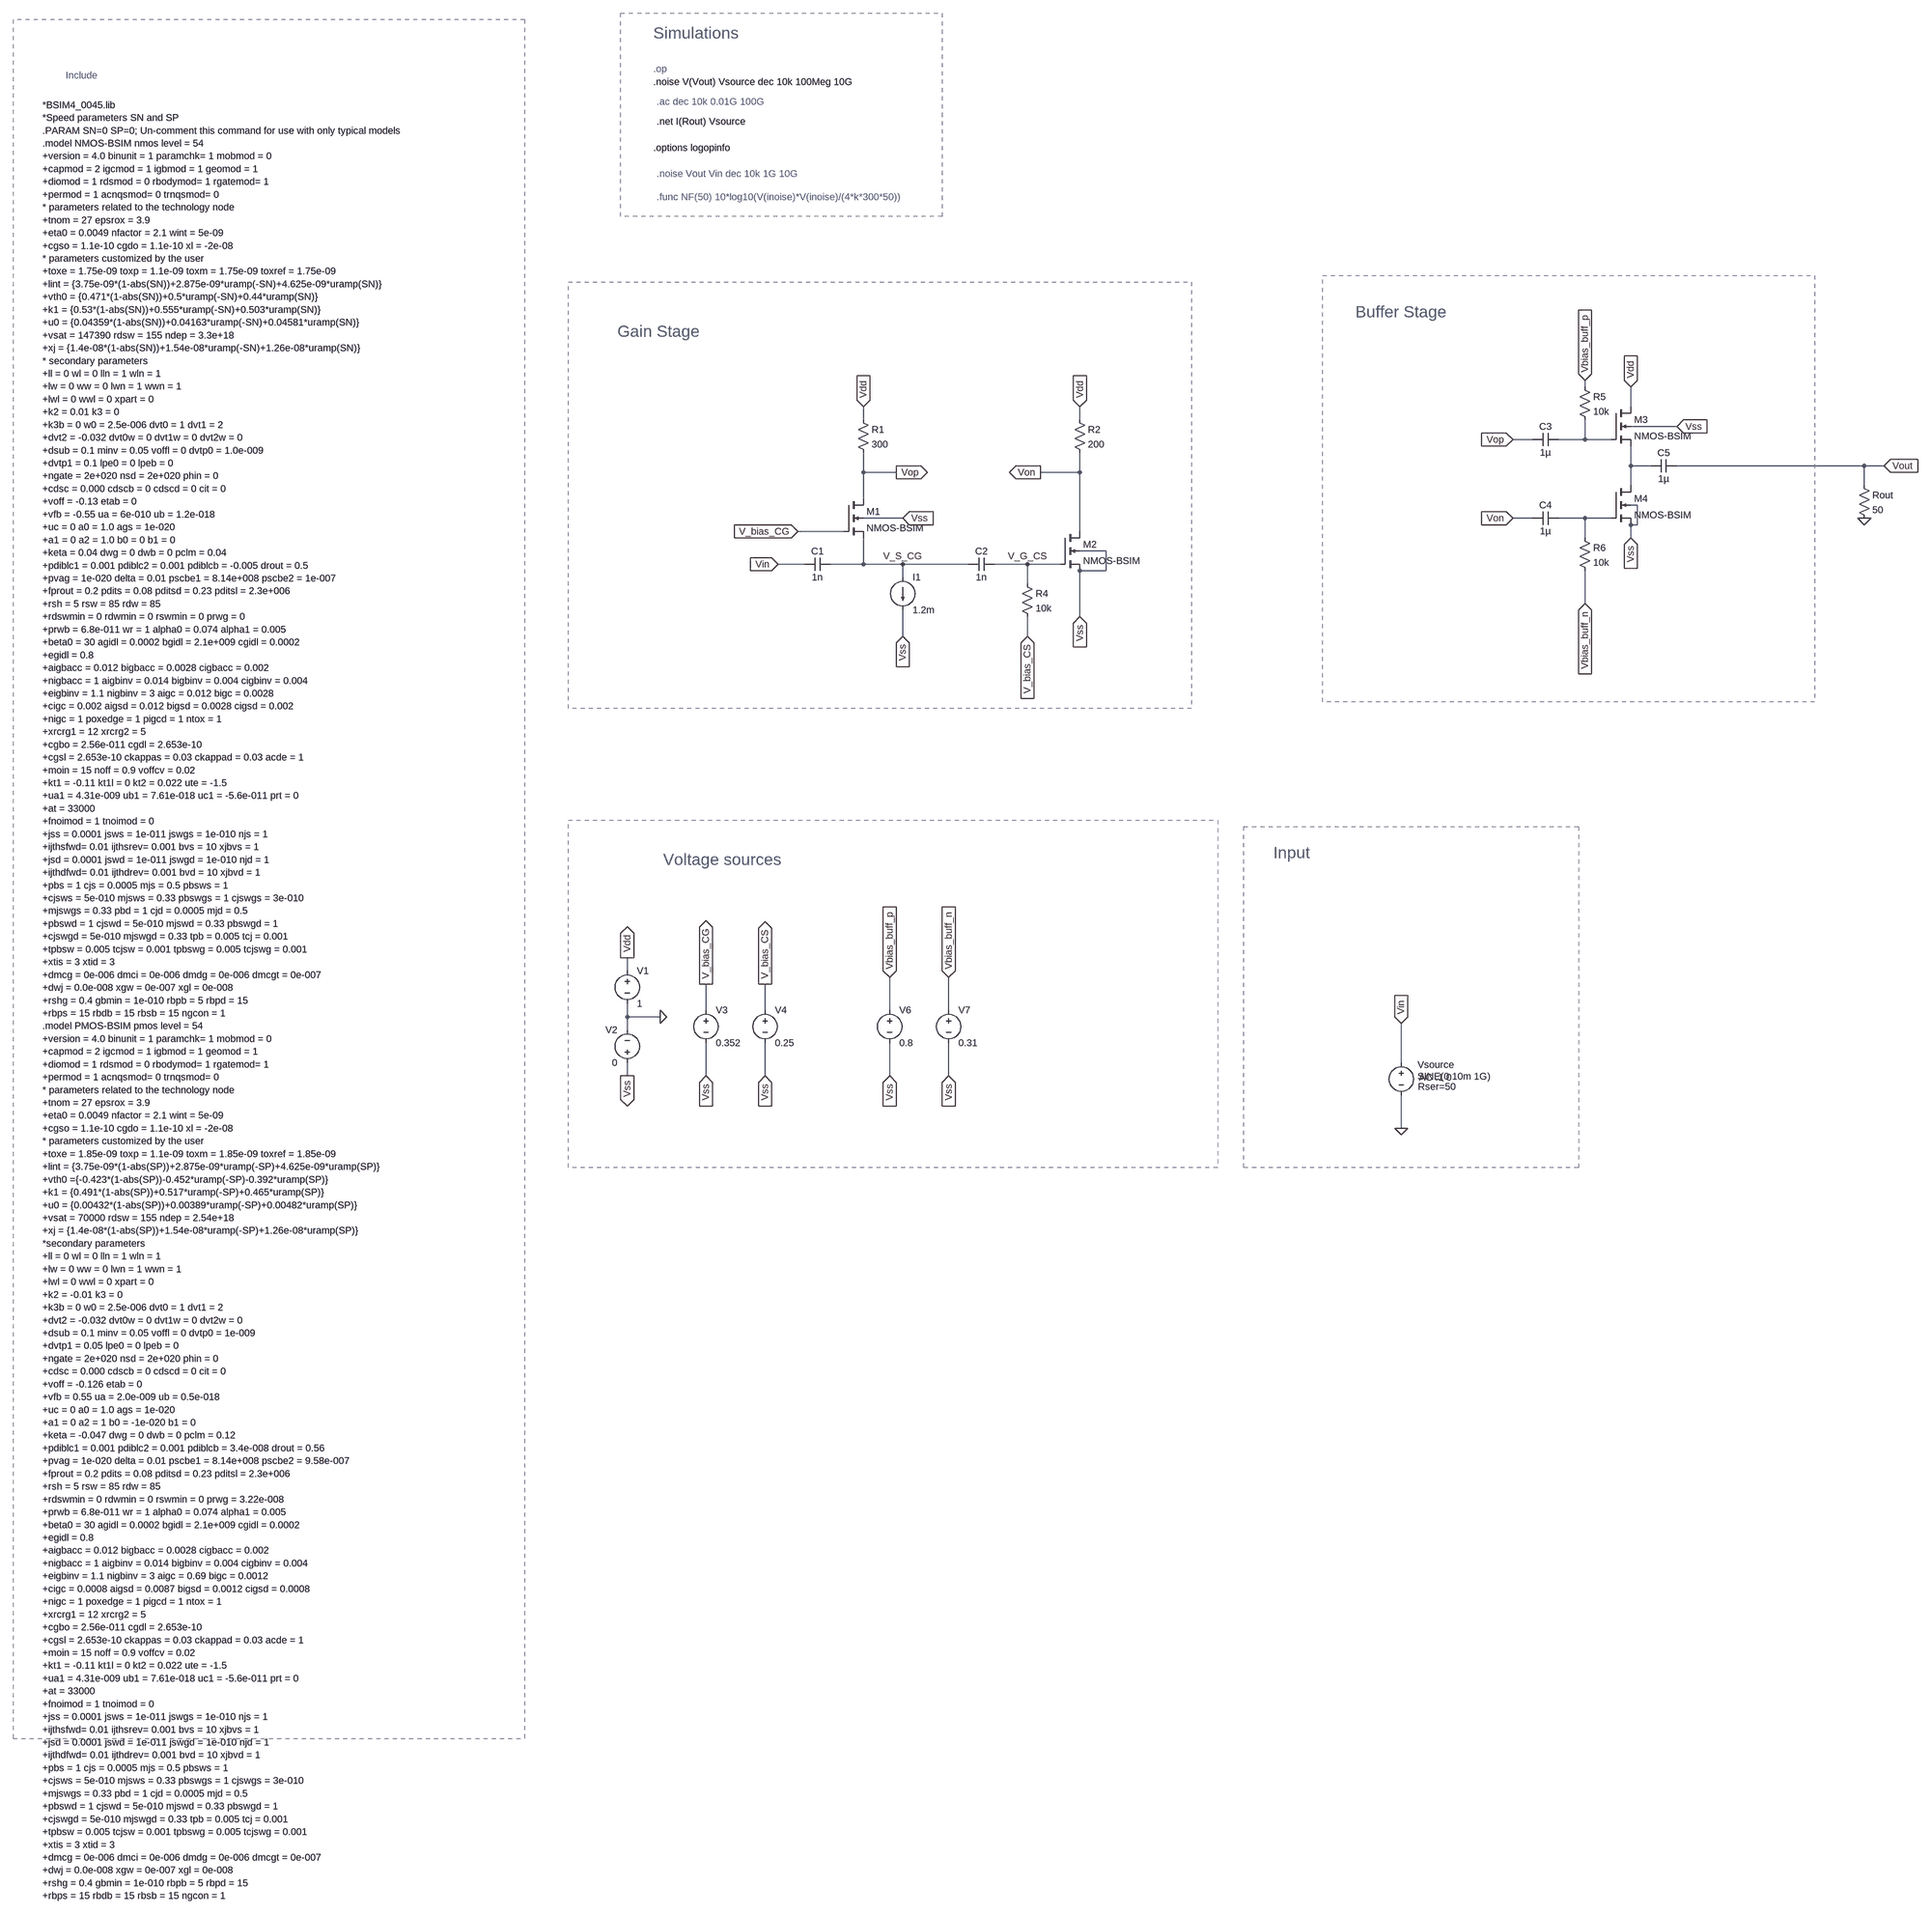
[diagram p0: schematic Nmos_LNA_45_1To1.asc]
Nmos_LNA_45_1To1.asc, the LTspice schematic file:
Version 4.1
SHEET 1 4244 3652
WIRE 3168 352 3168 336
WIRE 3280 400 3280 352
WIRE 1408 432 1408 400
WIRE 1936 432 1936 400
WIRE 3392 448 3280 448
WIRE 3040 480 2992 480
WIRE 3168 480 3168 432
WIRE 3168 480 3104 480
WIRE 3232 480 3168 480
WIRE 3280 544 3280 496
WIRE 3328 544 3280 544
WIRE 3856 544 3392 544
WIRE 3904 544 3856 544
WIRE 1408 560 1408 512
WIRE 1488 560 1408 560
WIRE 1936 560 1936 512
WIRE 1936 560 1840 560
WIRE 3280 592 3280 544
WIRE 3856 592 3856 544
WIRE 1408 624 1408 560
WIRE 3296 640 3280 640
WIRE 1504 672 1408 672
WIRE 3040 672 2992 672
WIRE 3168 672 3104 672
WIRE 3232 672 3168 672
WIRE 3296 688 3296 640
WIRE 3296 688 3280 688
WIRE 1360 704 1248 704
WIRE 1936 704 1936 560
WIRE 3168 720 3168 672
WIRE 3280 720 3280 688
WIRE 2000 752 1936 752
WIRE 1264 784 1200 784
WIRE 1408 784 1408 720
WIRE 1408 784 1328 784
WIRE 1504 784 1408 784
WIRE 1664 784 1504 784
WIRE 1808 784 1728 784
WIRE 1888 784 1808 784
WIRE 2000 800 2000 752
WIRE 2000 800 1936 800
WIRE 1504 816 1504 784
WIRE 1808 832 1808 784
WIRE 3168 880 3168 800
WIRE 1936 912 1936 800
WIRE 1504 960 1504 896
WIRE 1808 960 1808 912
WIRE 832 1776 832 1744
WIRE 1024 1872 1024 1808
WIRE 1168 1872 1168 1808
WIRE 1472 1872 1472 1792
WIRE 1616 1872 1616 1792
WIRE 832 1888 832 1856
WIRE 912 1888 832 1888
WIRE 832 1920 832 1888
WIRE 2720 2000 2720 1904
WIRE 832 2032 832 2000
WIRE 1024 2032 1024 1952
WIRE 1168 2032 1168 1952
WIRE 1472 2032 1472 1952
WIRE 1616 2032 1616 1952
WIRE 2720 2160 2720 2080
FLAG 1200 784 Vin
IOPIN 1200 784 In
FLAG 912 1888 0
FLAG 832 1744 Vdd
IOPIN 832 1744 Out
FLAG 832 2032 Vss
IOPIN 832 2032 Out
FLAG 1248 704 V_bias_CG
IOPIN 1248 704 In
FLAG 1504 960 Vss
IOPIN 1504 960 In
FLAG 1504 672 Vss
IOPIN 1504 672 In
FLAG 1936 912 Vss
IOPIN 1936 912 In
FLAG 1408 400 Vdd
IOPIN 1408 400 In
FLAG 1936 400 Vdd
IOPIN 1936 400 In
FLAG 1024 2032 Vss
IOPIN 1024 2032 In
FLAG 1024 1808 V_bias_CG
IOPIN 1024 1808 Out
FLAG 1488 560 Vop
IOPIN 1488 560 Out
FLAG 1840 560 Von
IOPIN 1840 560 Out
FLAG 1808 960 V_bias_CS
IOPIN 1808 960 In
FLAG 1168 1808 V_bias_CS
IOPIN 1168 1808 Out
FLAG 1168 2032 Vss
IOPIN 1168 2032 In
FLAG 2720 2160 0
FLAG 2720 1904 Vin
IOPIN 2720 1904 In
FLAG 1808 784 V_G_CS
FLAG 1504 784 V_S_CG
FLAG 3392 448 Vss
IOPIN 3392 448 In
FLAG 3280 720 Vss
IOPIN 3280 720 In
FLAG 2992 480 Vop
IOPIN 2992 480 In
FLAG 2992 672 Von
IOPIN 2992 672 In
FLAG 3280 352 Vdd
IOPIN 3280 352 In
FLAG 3904 544 Vout
IOPIN 3904 544 In
FLAG 3168 880 Vbias_buff_n
IOPIN 3168 880 In
FLAG 3168 336 Vbias_buff_p
IOPIN 3168 336 In
FLAG 1472 2032 Vss
IOPIN 1472 2032 In
FLAG 1616 2032 Vss
IOPIN 1616 2032 In
FLAG 1472 1792 Vbias_buff_p
IOPIN 1472 1792 In
FLAG 1616 1792 Vbias_buff_n
IOPIN 1616 1792 In
FLAG 3856 672 0
DATAFLAG 1936 560 ""
DATAFLAG 3296 544 ""
DATAFLAG 1408 784 ""
DATAFLAG 1248 784 ""
DATAFLAG 1248 784 ""
DATAFLAG 1936 624 ""
DATAFLAG 1408 560 ""
SYMBOL voltage 832 1760 R0
WINDOW 123 0 0 Left 0
WINDOW 39 0 0 Left 0
SYMATTR InstName V1
SYMATTR Value 1
SYMBOL voltage 832 2016 R180
WINDOW 0 24 96 Left 2
WINDOW 3 24 16 Left 2
WINDOW 123 0 0 Left 0
WINDOW 39 0 0 Left 0
SYMATTR InstName V2
SYMATTR Value 0
SYMBOL current 1504 816 R0
WINDOW 123 0 0 Left 0
WINDOW 39 0 0 Left 0
SYMATTR InstName I1
SYMATTR Value 1.2m
SYMBOL res 1392 416 R0
SYMATTR InstName R1
SYMATTR Value 300
SYMBOL res 1920 416 R0
SYMATTR InstName R2
SYMATTR Value 200
SYMBOL voltage 1024 1856 R0
WINDOW 123 0 0 Left 0
WINDOW 39 0 0 Left 0
SYMATTR InstName V3
SYMATTR Value 0.352
SYMBOL cap 1328 768 R90
WINDOW 0 0 32 VBottom 2
WINDOW 3 32 32 VTop 2
SYMATTR InstName C1
SYMATTR Value 1n
SYMBOL cap 1728 768 R90
WINDOW 0 0 32 VBottom 2
WINDOW 3 32 32 VTop 2
SYMATTR InstName C2
SYMATTR Value 1n
SYMBOL voltage 1168 1856 R0
WINDOW 123 0 0 Left 0
WINDOW 39 0 0 Left 0
SYMATTR InstName V4
SYMATTR Value 0.25
SYMBOL nmos4 1888 704 R0
SYMATTR InstName M2
SYMATTR Value NMOS-BSIM
SYMATTR Value2 l=60n w=25u
SYMBOL nmos4 1360 624 R0
SYMATTR InstName M1
SYMATTR Value NMOS-BSIM
SYMATTR Value2 l=80n w=40u
SYMBOL voltage 2720 1984 R0
WINDOW 123 43 52 Left 2
WINDOW 39 41 74 Left 2
WINDOW 0 40 21 Left 2
WINDOW 3 40 49 Left 2
SYMATTR Value2 AC .1 0
SYMATTR SpiceLine Rser=50
SYMATTR InstName Vsource
SYMATTR Value SINE(0 10m 1G)
SYMBOL res 1792 816 R0
SYMATTR InstName R4
SYMATTR Value 10k
SYMBOL cap 3104 464 R90
WINDOW 0 0 32 VBottom 2
WINDOW 3 32 32 VTop 2
SYMATTR InstName C3
SYMATTR Value 1µ
SYMBOL cap 3104 656 R90
WINDOW 0 0 32 VBottom 2
WINDOW 3 32 32 VTop 2
SYMATTR InstName C4
SYMATTR Value 1µ
SYMBOL nmos4 3232 400 R0
SYMATTR InstName M3
SYMATTR Value NMOS-BSIM
SYMATTR Value2 l=90n w=65u
SYMBOL nmos4 3232 592 R0
SYMATTR InstName M4
SYMATTR Value NMOS-BSIM
SYMATTR Value2 l=90n w=65u
SYMBOL voltage 1472 1856 R0
WINDOW 123 0 0 Left 0
WINDOW 39 0 0 Left 0
SYMATTR InstName V6
SYMATTR Value 0.8
SYMBOL voltage 1616 1856 R0
WINDOW 123 0 0 Left 0
WINDOW 39 0 0 Left 0
SYMATTR InstName V7
SYMATTR Value 0.31
SYMBOL res 3152 336 R0
SYMATTR InstName R5
SYMATTR Value 10k
SYMBOL res 3152 704 R0
SYMATTR InstName R6
SYMATTR Value 10k
SYMBOL cap 3392 528 R90
WINDOW 0 0 32 VBottom 2
WINDOW 3 32 32 VTop 2
SYMATTR InstName C5
SYMATTR Value 1µ
SYMBOL res 3840 576 R0
SYMATTR InstName Rout
SYMATTR Value 50
TEXT -1064 -336 Left 2 !*BSIM4_0045.lib\n*Speed parameters SN and SP\n.PARAM SN=0 SP=0; Un-comment this command for use with only typical models\n.model NMOS-BSIM nmos level = 54\n+version = 4.0 binunit = 1 paramchk= 1 mobmod = 0\n+capmod = 2 igcmod = 1 igbmod = 1 geomod = 1\n+diomod = 1 rdsmod = 0 rbodymod= 1 rgatemod= 1\n+permod = 1 acnqsmod= 0 trnqsmod= 0\n* parameters related to the technology node\n+tnom = 27 epsrox = 3.9\n+eta0 = 0.0049 nfactor = 2.1 wint = 5e-09\n+cgso = 1.1e-10 cgdo = 1.1e-10 xl = -2e-08\n* parameters customized by the user\n+toxe = 1.75e-09 toxp = 1.1e-09 toxm = 1.75e-09 toxref = 1.75e-09\n+lint = {3.75e-09*(1-abs(SN))+2.875e-09*uramp(-SN)+4.625e-09*uramp(SN)}\n+vth0 = {0.471*(1-abs(SN))+0.5*uramp(-SN)+0.44*uramp(SN)}\n+k1 = {0.53*(1-abs(SN))+0.555*uramp(-SN)+0.503*uramp(SN)}\n+u0 = {0.04359*(1-abs(SN))+0.04163*uramp(-SN)+0.04581*uramp(SN)}\n+vsat = 147390 rdsw = 155 ndep = 3.3e+18\n+xj = {1.4e-08*(1-abs(SN))+1.54e-08*uramp(-SN)+1.26e-08*uramp(SN)}\n* secondary parameters\n+ll = 0 wl = 0 lln = 1 wln = 1\n+lw = 0 ww = 0 lwn = 1 wwn = 1\n+lwl = 0 wwl = 0 xpart = 0\n+k2 = 0.01 k3 = 0\n+k3b = 0 w0 = 2.5e-006 dvt0 = 1 dvt1 = 2\n+dvt2 = -0.032 dvt0w = 0 dvt1w = 0 dvt2w = 0\n+dsub = 0.1 minv = 0.05 voffl = 0 dvtp0 = 1.0e-009\n+dvtp1 = 0.1 lpe0 = 0 lpeb = 0\n+ngate = 2e+020 nsd = 2e+020 phin = 0\n+cdsc = 0.000 cdscb = 0 cdscd = 0 cit = 0\n+voff = -0.13 etab = 0\n+vfb = -0.55 ua = 6e-010 ub = 1.2e-018\n+uc = 0 a0 = 1.0 ags = 1e-020\n+a1 = 0 a2 = 1.0 b0 = 0 b1 = 0\n+keta = 0.04 dwg = 0 dwb = 0 pclm = 0.04\n+pdiblc1 = 0.001 pdiblc2 = 0.001 pdiblcb = -0.005 drout = 0.5\n+pvag = 1e-020 delta = 0.01 pscbe1 = 8.14e+008 pscbe2 = 1e-007\n+fprout = 0.2 pdits = 0.08 pditsd = 0.23 pditsl = 2.3e+006\n+rsh = 5 rsw = 85 rdw = 85\n+rdswmin = 0 rdwmin = 0 rswmin = 0 prwg = 0\n+prwb = 6.8e-011 wr = 1 alpha0 = 0.074 alpha1 = 0.005\n+beta0 = 30 agidl = 0.0002 bgidl = 2.1e+009 cgidl = 0.0002\n+egidl = 0.8\n+aigbacc = 0.012 bigbacc = 0.0028 cigbacc = 0.002\n+nigbacc = 1 aigbinv = 0.014 bigbinv = 0.004 cigbinv = 0.004\n+eigbinv = 1.1 nigbinv = 3 aigc = 0.012 bigc = 0.0028\n+cigc = 0.002 aigsd = 0.012 bigsd = 0.0028 cigsd = 0.002\n+nigc = 1 poxedge = 1 pigcd = 1 ntox = 1\n+xrcrg1 = 12 xrcrg2 = 5\n+cgbo = 2.56e-011 cgdl = 2.653e-10\n+cgsl = 2.653e-10 ckappas = 0.03 ckappad = 0.03 acde = 1\n+moin = 15 noff = 0.9 voffcv = 0.02\n+kt1 = -0.11 kt1l = 0 kt2 = 0.022 ute = -1.5\n+ua1 = 4.31e-009 ub1 = 7.61e-018 uc1 = -5.6e-011 prt = 0\n+at = 33000\n+fnoimod = 1 tnoimod = 0\n+jss = 0.0001 jsws = 1e-011 jswgs = 1e-010 njs = 1\n+ijthsfwd= 0.01 ijthsrev= 0.001 bvs = 10 xjbvs = 1\n+jsd = 0.0001 jswd = 1e-011 jswgd = 1e-010 njd = 1\n+ijthdfwd= 0.01 ijthdrev= 0.001 bvd = 10 xjbvd = 1\n+pbs = 1 cjs = 0.0005 mjs = 0.5 pbsws = 1\n+cjsws = 5e-010 mjsws = 0.33 pbswgs = 1 cjswgs = 3e-010\n+mjswgs = 0.33 pbd = 1 cjd = 0.0005 mjd = 0.5\n+pbswd = 1 cjswd = 5e-010 mjswd = 0.33 pbswgd = 1\n+cjswgd = 5e-010 mjswgd = 0.33 tpb = 0.005 tcj = 0.001\n+tpbsw = 0.005 tcjsw = 0.001 tpbswg = 0.005 tcjswg = 0.001\n+xtis = 3 xtid = 3\n+dmcg = 0e-006 dmci = 0e-006 dmdg = 0e-006 dmcgt = 0e-007\n+dwj = 0.0e-008 xgw = 0e-007 xgl = 0e-008\n+rshg = 0.4 gbmin = 1e-010 rbpb = 5 rbpd = 15\n+rbps = 15 rbdb = 15 rbsb = 15 ngcon = 1\n.model PMOS-BSIM pmos level = 54\n+version = 4.0 binunit = 1 paramchk= 1 mobmod = 0\n+capmod = 2 igcmod = 1 igbmod = 1 geomod = 1\n+diomod = 1 rdsmod = 0 rbodymod= 1 rgatemod= 1\n+permod = 1 acnqsmod= 0 trnqsmod= 0\n* parameters related to the technology node\n+tnom = 27 epsrox = 3.9\n+eta0 = 0.0049 nfactor = 2.1 wint = 5e-09\n+cgso = 1.1e-10 cgdo = 1.1e-10 xl = -2e-08\n* parameters customized by the user\n+toxe = 1.85e-09 toxp = 1.1e-09 toxm = 1.85e-09 toxref = 1.85e-09\n+lint = {3.75e-09*(1-abs(SP))+2.875e-09*uramp(-SP)+4.625e-09*uramp(SP)}\n+vth0 ={-0.423*(1-abs(SP))-0.452*uramp(-SP)-0.392*uramp(SP)}\n+k1 = {0.491*(1-abs(SP))+0.517*uramp(-SP)+0.465*uramp(SP)}\n+u0 = {0.00432*(1-abs(SP))+0.00389*uramp(-SP)+0.00482*uramp(SP)}\n+vsat = 70000 rdsw = 155 ndep = 2.54e+18\n+xj = {1.4e-08*(1-abs(SP))+1.54e-08*uramp(-SP)+1.26e-08*uramp(SP)}\n*secondary parameters\n+ll = 0 wl = 0 lln = 1 wln = 1\n+lw = 0 ww = 0 lwn = 1 wwn = 1\n+lwl = 0 wwl = 0 xpart = 0\n+k2 = -0.01 k3 = 0\n+k3b = 0 w0 = 2.5e-006 dvt0 = 1 dvt1 = 2\n+dvt2 = -0.032 dvt0w = 0 dvt1w = 0 dvt2w = 0\n+dsub = 0.1 minv = 0.05 voffl = 0 dvtp0 = 1e-009\n+dvtp1 = 0.05 lpe0 = 0 lpeb = 0\n+ngate = 2e+020 nsd = 2e+020 phin = 0\n+cdsc = 0.000 cdscb = 0 cdscd = 0 cit = 0\n+voff = -0.126 etab = 0\n+vfb = 0.55 ua = 2.0e-009 ub = 0.5e-018\n+uc = 0 a0 = 1.0 ags = 1e-020\n+a1 = 0 a2 = 1 b0 = -1e-020 b1 = 0\n+keta = -0.047 dwg = 0 dwb = 0 pclm = 0.12\n+pdiblc1 = 0.001 pdiblc2 = 0.001 pdiblcb = 3.4e-008 drout = 0.56\n+pvag = 1e-020 delta = 0.01 pscbe1 = 8.14e+008 pscbe2 = 9.58e-007\n+fprout = 0.2 pdits = 0.08 pditsd = 0.23 pditsl = 2.3e+006\n+rsh = 5 rsw = 85 rdw = 85\n+rdswmin = 0 rdwmin = 0 rswmin = 0 prwg = 3.22e-008\n+prwb = 6.8e-011 wr = 1 alpha0 = 0.074 alpha1 = 0.005\n+beta0 = 30 agidl = 0.0002 bgidl = 2.1e+009 cgidl = 0.0002\n+egidl = 0.8\n+aigbacc = 0.012 bigbacc = 0.0028 cigbacc = 0.002\n+nigbacc = 1 aigbinv = 0.014 bigbinv = 0.004 cigbinv = 0.004\n+eigbinv = 1.1 nigbinv = 3 aigc = 0.69 bigc = 0.0012\n+cigc = 0.0008 aigsd = 0.0087 bigsd = 0.0012 cigsd = 0.0008\n+nigc = 1 poxedge = 1 pigcd = 1 ntox = 1\n+xrcrg1 = 12 xrcrg2 = 5\n+cgbo = 2.56e-011 cgdl = 2.653e-10\n+cgsl = 2.653e-10 ckappas = 0.03 ckappad = 0.03 acde = 1\n+moin = 15 noff = 0.9 voffcv = 0.02\n+kt1 = -0.11 kt1l = 0 kt2 = 0.022 ute = -1.5\n+ua1 = 4.31e-009 ub1 = 7.61e-018 uc1 = -5.6e-011 prt = 0\n+at = 33000\n+fnoimod = 1 tnoimod = 0\n+jss = 0.0001 jsws = 1e-011 jswgs = 1e-010 njs = 1\n+ijthsfwd= 0.01 ijthsrev= 0.001 bvs = 10 xjbvs = 1\n+jsd = 0.0001 jswd = 1e-011 jswgd = 1e-010 njd = 1\n+ijthdfwd= 0.01 ijthdrev= 0.001 bvd = 10 xjbvd = 1\n+pbs = 1 cjs = 0.0005 mjs = 0.5 pbsws = 1\n+cjsws = 5e-010 mjsws = 0.33 pbswgs = 1 cjswgs = 3e-010\n+mjswgs = 0.33 pbd = 1 cjd = 0.0005 mjd = 0.5\n+pbswd = 1 cjswd = 5e-010 mjswd = 0.33 pbswgd = 1\n+cjswgd = 5e-010 mjswgd = 0.33 tpb = 0.005 tcj = 0.001\n+tpbsw = 0.005 tcjsw = 0.001 tpbswg = 0.005 tcjswg = 0.001\n+xtis = 3 xtid = 3\n+dmcg = 0e-006 dmci = 0e-006 dmdg = 0e-006 dmcgt = 0e-007\n+dwj = 0.0e-008 xgw = 0e-007 xgl = 0e-008\n+rshg = 0.4 gbmin = 1e-010 rbpb = 5 rbpd = 15\n+rbps = 15 rbdb = 15 rbsb = 15 ngcon = 1
TEXT 920 1504 Left 4 ;Voltage sources
TEXT 896 -424 Left 2 ;.op
TEXT -1008 -408 Left 2 ;Include
TEXT 896 -232 Left 2 !.options logopinfo
TEXT 896 -392 Left 2 !.noise V(Vout) Vsource dec 10k 100Meg 10G
TEXT 904 -296 Left 2 !.net I(Rout) Vsource
TEXT 904 -344 Left 2 ;.ac dec 10k 0.01G 100G
TEXT 896 -512 Left 4 ;Simulations
TEXT 2408 1488 Left 4 ;Input
TEXT 808 216 Left 4 ;Gain Stage
TEXT 2608 168 Left 4 ;Buffer Stage
TEXT 904 -168 Left 2 ;.noise Vout Vin dec 10k 1G 10G
TEXT 904 -112 Left 2 ;.func NF(50) 10*log10(V(inoise)*V(inoise)/(4*k*300*50))
RECTANGLE Normal 2272 2256 688 1408 2
RECTANGLE Normal 3152 2256 2336 1424 2
RECTANGLE Normal 2208 1136 688 96 2
RECTANGLE Normal 3728 1120 2528 80 2
RECTANGLE Normal -1136 3648 112 -544 2
RECTANGLE Normal 1600 -64 816 -560 2

The netlist it stands for:
* Nmos_LNA_45_1To1.asc
V1 Vdd 0 1
V2 Vss 0 0
I1 V_S_CG Vss 1.2m
R1 Vdd Vop 300
R2 Vdd Von 200
V3 V_bias_CG Vss 0.352
C1 V_S_CG Vin 1n
C2 V_G_CS V_S_CG 1n
V4 V_bias_CS Vss 0.25
M2 Von V_G_CS Vss Vss NMOS-BSIM l=60n w=25u
M1 Vop V_bias_CG V_S_CG Vss NMOS-BSIM l=80n w=40u
Vsource Vin 0 SINE(0 10m 1G) AC .1 0 Rser=50
R4 V_G_CS V_bias_CS 10k
C3 N001 Vop 1µ
C4 N003 Von 1µ
M3 Vdd N001 N002 Vss NMOS-BSIM l=90n w=65u
M4 N002 N003 Vss Vss NMOS-BSIM l=90n w=65u
V6 Vbias_buff_p Vss 0.8
V7 Vbias_buff_n Vss 0.31
R5 Vbias_buff_p N001 10k
R6 N003 Vbias_buff_n 10k
C5 Vout N002 1µ
Rout Vout 0 50
.model NMOS NMOS
.model PMOS PMOS
.lib standard.mos
*BSIM4_0045.lib
*Speed parameters SN and SP
.PARAM SN=0 SP=0; Un-comment this command for use with only typical models
.model NMOS-BSIM nmos level = 54
+version = 4.0 binunit = 1 paramchk= 1 mobmod = 0
+capmod = 2 igcmod = 1 igbmod = 1 geomod = 1
+diomod = 1 rdsmod = 0 rbodymod= 1 rgatemod= 1
+permod = 1 acnqsmod= 0 trnqsmod= 0
* parameters related to the technology node
+tnom = 27 epsrox = 3.9
+eta0 = 0.0049 nfactor = 2.1 wint = 5e-09
+cgso = 1.1e-10 cgdo = 1.1e-10 xl = -2e-08
* parameters customized by the user
+toxe = 1.75e-09 toxp = 1.1e-09 toxm = 1.75e-09 toxref = 1.75e-09
+lint = {3.75e-09*(1-abs(SN))+2.875e-09*uramp(-SN)+4.625e-09*uramp(SN)}
+vth0 = {0.471*(1-abs(SN))+0.5*uramp(-SN)+0.44*uramp(SN)}
+k1 = {0.53*(1-abs(SN))+0.555*uramp(-SN)+0.503*uramp(SN)}
+u0 = {0.04359*(1-abs(SN))+0.04163*uramp(-SN)+0.04581*uramp(SN)}
+vsat = 147390 rdsw = 155 ndep = 3.3e+18
+xj = {1.4e-08*(1-abs(SN))+1.54e-08*uramp(-SN)+1.26e-08*uramp(SN)}
* secondary parameters
+ll = 0 wl = 0 lln = 1 wln = 1
+lw = 0 ww = 0 lwn = 1 wwn = 1
+lwl = 0 wwl = 0 xpart = 0
+k2 = 0.01 k3 = 0
+k3b = 0 w0 = 2.5e-006 dvt0 = 1 dvt1 = 2
+dvt2 = -0.032 dvt0w = 0 dvt1w = 0 dvt2w = 0
+dsub = 0.1 minv = 0.05 voffl = 0 dvtp0 = 1.0e-009
+dvtp1 = 0.1 lpe0 = 0 lpeb = 0
+ngate = 2e+020 nsd = 2e+020 phin = 0
+cdsc = 0.000 cdscb = 0 cdscd = 0 cit = 0
+voff = -0.13 etab = 0
+vfb = -0.55 ua = 6e-010 ub = 1.2e-018
+uc = 0 a0 = 1.0 ags = 1e-020
+a1 = 0 a2 = 1.0 b0 = 0 b1 = 0
+keta = 0.04 dwg = 0 dwb = 0 pclm = 0.04
+pdiblc1 = 0.001 pdiblc2 = 0.001 pdiblcb = -0.005 drout = 0.5
+pvag = 1e-020 delta = 0.01 pscbe1 = 8.14e+008 pscbe2 = 1e-007
+fprout = 0.2 pdits = 0.08 pditsd = 0.23 pditsl = 2.3e+006
+rsh = 5 rsw = 85 rdw = 85
+rdswmin = 0 rdwmin = 0 rswmin = 0 prwg = 0
+prwb = 6.8e-011 wr = 1 alpha0 = 0.074 alpha1 = 0.005
+beta0 = 30 agidl = 0.0002 bgidl = 2.1e+009 cgidl = 0.0002
+egidl = 0.8
+aigbacc = 0.012 bigbacc = 0.0028 cigbacc = 0.002
+nigbacc = 1 aigbinv = 0.014 bigbinv = 0.004 cigbinv = 0.004
+eigbinv = 1.1 nigbinv = 3 aigc = 0.012 bigc = 0.0028
+cigc = 0.002 aigsd = 0.012 bigsd = 0.0028 cigsd = 0.002
+nigc = 1 poxedge = 1 pigcd = 1 ntox = 1
+xrcrg1 = 12 xrcrg2 = 5
+cgbo = 2.56e-011 cgdl = 2.653e-10
+cgsl = 2.653e-10 ckappas = 0.03 ckappad = 0.03 acde = 1
+moin = 15 noff = 0.9 voffcv = 0.02
+kt1 = -0.11 kt1l = 0 kt2 = 0.022 ute = -1.5
+ua1 = 4.31e-009 ub1 = 7.61e-018 uc1 = -5.6e-011 prt = 0
+at = 33000
+fnoimod = 1 tnoimod = 0
+jss = 0.0001 jsws = 1e-011 jswgs = 1e-010 njs = 1
+ijthsfwd= 0.01 ijthsrev= 0.001 bvs = 10 xjbvs = 1
+jsd = 0.0001 jswd = 1e-011 jswgd = 1e-010 njd = 1
+ijthdfwd= 0.01 ijthdrev= 0.001 bvd = 10 xjbvd = 1
+pbs = 1 cjs = 0.0005 mjs = 0.5 pbsws = 1
+cjsws = 5e-010 mjsws = 0.33 pbswgs = 1 cjswgs = 3e-010
+mjswgs = 0.33 pbd = 1 cjd = 0.0005 mjd = 0.5
+pbswd = 1 cjswd = 5e-010 mjswd = 0.33 pbswgd = 1
+cjswgd = 5e-010 mjswgd = 0.33 tpb = 0.005 tcj = 0.001
+tpbsw = 0.005 tcjsw = 0.001 tpbswg = 0.005 tcjswg = 0.001
+xtis = 3 xtid = 3
+dmcg = 0e-006 dmci = 0e-006 dmdg = 0e-006 dmcgt = 0e-007
+dwj = 0.0e-008 xgw = 0e-007 xgl = 0e-008
+rshg = 0.4 gbmin = 1e-010 rbpb = 5 rbpd = 15
+rbps = 15 rbdb = 15 rbsb = 15 ngcon = 1
.model PMOS-BSIM pmos level = 54
+version = 4.0 binunit = 1 paramchk= 1 mobmod = 0
+capmod = 2 igcmod = 1 igbmod = 1 geomod = 1
+diomod = 1 rdsmod = 0 rbodymod= 1 rgatemod= 1
+permod = 1 acnqsmod= 0 trnqsmod= 0
* parameters related to the technology node
+tnom = 27 epsrox = 3.9
+eta0 = 0.0049 nfactor = 2.1 wint = 5e-09
+cgso = 1.1e-10 cgdo = 1.1e-10 xl = -2e-08
* parameters customized by the user
+toxe = 1.85e-09 toxp = 1.1e-09 toxm = 1.85e-09 toxref = 1.85e-09
+lint = {3.75e-09*(1-abs(SP))+2.875e-09*uramp(-SP)+4.625e-09*uramp(SP)}
+vth0 ={-0.423*(1-abs(SP))-0.452*uramp(-SP)-0.392*uramp(SP)}
+k1 = {0.491*(1-abs(SP))+0.517*uramp(-SP)+0.465*uramp(SP)}
+u0 = {0.00432*(1-abs(SP))+0.00389*uramp(-SP)+0.00482*uramp(SP)}
+vsat = 70000 rdsw = 155 ndep = 2.54e+18
+xj = {1.4e-08*(1-abs(SP))+1.54e-08*uramp(-SP)+1.26e-08*uramp(SP)}
*secondary parameters
+ll = 0 wl = 0 lln = 1 wln = 1
+lw = 0 ww = 0 lwn = 1 wwn = 1
+lwl = 0 wwl = 0 xpart = 0
+k2 = -0.01 k3 = 0
+k3b = 0 w0 = 2.5e-006 dvt0 = 1 dvt1 = 2
+dvt2 = -0.032 dvt0w = 0 dvt1w = 0 dvt2w = 0
+dsub = 0.1 minv = 0.05 voffl = 0 dvtp0 = 1e-009
+dvtp1 = 0.05 lpe0 = 0 lpeb = 0
+ngate = 2e+020 nsd = 2e+020 phin = 0
+cdsc = 0.000 cdscb = 0 cdscd = 0 cit = 0
+voff = -0.126 etab = 0
+vfb = 0.55 ua = 2.0e-009 ub = 0.5e-018
+uc = 0 a0 = 1.0 ags = 1e-020
+a1 = 0 a2 = 1 b0 = -1e-020 b1 = 0
+keta = -0.047 dwg = 0 dwb = 0 pclm = 0.12
+pdiblc1 = 0.001 pdiblc2 = 0.001 pdiblcb = 3.4e-008 drout = 0.56
+pvag = 1e-020 delta = 0.01 pscbe1 = 8.14e+008 pscbe2 = 9.58e-007
+fprout = 0.2 pdits = 0.08 pditsd = 0.23 pditsl = 2.3e+006
+rsh = 5 rsw = 85 rdw = 85
+rdswmin = 0 rdwmin = 0 rswmin = 0 prwg = 3.22e-008
+prwb = 6.8e-011 wr = 1 alpha0 = 0.074 alpha1 = 0.005
+beta0 = 30 agidl = 0.0002 bgidl = 2.1e+009 cgidl = 0.0002
+egidl = 0.8
+aigbacc = 0.012 bigbacc = 0.0028 cigbacc = 0.002
+nigbacc = 1 aigbinv = 0.014 bigbinv = 0.004 cigbinv = 0.004
+eigbinv = 1.1 nigbinv = 3 aigc = 0.69 bigc = 0.0012
+cigc = 0.0008 aigsd = 0.0087 bigsd = 0.0012 cigsd = 0.0008
+nigc = 1 poxedge = 1 pigcd = 1 ntox = 1
+xrcrg1 = 12 xrcrg2 = 5
+cgbo = 2.56e-011 cgdl = 2.653e-10
+cgsl = 2.653e-10 ckappas = 0.03 ckappad = 0.03 acde = 1
+moin = 15 noff = 0.9 voffcv = 0.02
+kt1 = -0.11 kt1l = 0 kt2 = 0.022 ute = -1.5
+ua1 = 4.31e-009 ub1 = 7.61e-018 uc1 = -5.6e-011 prt = 0
+at = 33000
+fnoimod = 1 tnoimod = 0
+jss = 0.0001 jsws = 1e-011 jswgs = 1e-010 njs = 1
+ijthsfwd= 0.01 ijthsrev= 0.001 bvs = 10 xjbvs = 1
+jsd = 0.0001 jswd = 1e-011 jswgd = 1e-010 njd = 1
+ijthdfwd= 0.01 ijthdrev= 0.001 bvd = 10 xjbvd = 1
+pbs = 1 cjs = 0.0005 mjs = 0.5 pbsws = 1
+cjsws = 5e-010 mjsws = 0.33 pbswgs = 1 cjswgs = 3e-010
+mjswgs = 0.33 pbd = 1 cjd = 0.0005 mjd = 0.5
+pbswd = 1 cjswd = 5e-010 mjswd = 0.33 pbswgd = 1
+cjswgd = 5e-010 mjswgd = 0.33 tpb = 0.005 tcj = 0.001
+tpbsw = 0.005 tcjsw = 0.001 tpbswg = 0.005 tcjswg = 0.001
+xtis = 3 xtid = 3
+dmcg = 0e-006 dmci = 0e-006 dmdg = 0e-006 dmcgt = 0e-007
+dwj = 0.0e-008 xgw = 0e-007 xgl = 0e-008
+rshg = 0.4 gbmin = 1e-010 rbpb = 5 rbpd = 15
+rbps = 15 rbdb = 15 rbsb = 15 ngcon = 1
* Voltage sources
* .op
* Include
.options logopinfo
.noise V(Vout) Vsource dec 10k 100Meg 10G
.net I(Rout) Vsource
* .ac dec 10k 0.01G 100G
* Simulations
* Input
* Gain Stage
* Buffer Stage
* .noise Vout Vin dec 10k 1G 10G
* .func NF(50) 10*log10(V(inoise)*V(inoise)/(4*k*300*50))
.backanno
.end